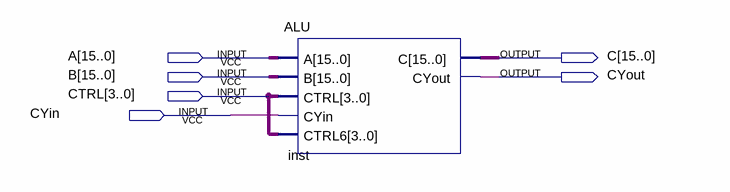
[diagram p0: schematic sheet]
// Quartus schematic maintest.bdf as structural Verilog: 1 symbols, 6 pins
module maintest (
  input  [15:0] A,
  input  [15:0] B,
  input  [3:0] CTRL,
  input  CYin,
  output [15:0] C,
  output CYout
);

  ALU inst (.A(A), .B(B), .CTRL(CTRL), .CYin(CYin), .CTRL6(CTRL), .C(C), .CYout(CYout));
endmodule
